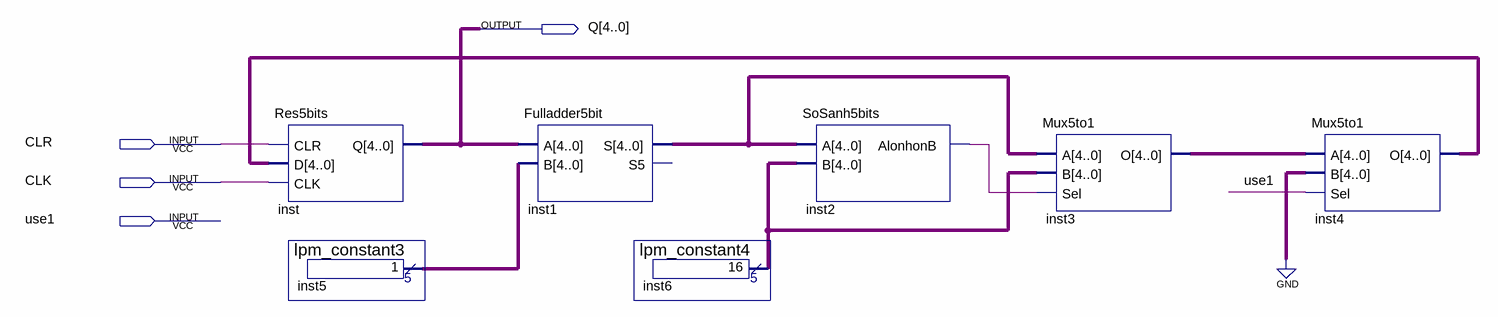
[diagram p0: schematic sheet]
// Quartus schematic Cooldown_block.bdf as structural Verilog: 7 symbols, 4 pins
module Cooldown_block (
  input  CLR,
  input  CLK,
  input  use1,
  output [4:0] Q
);

  wire inst2_alonhonb;
  wire [4:0] inst1_s, inst3_o, inst4_o, inst5_result, inst6_result;

  Res5bits inst (.CLR(CLR), .D(inst4_o), .CLK(CLK), .Q(Q));
  lpm_constant3 inst5 (.result(inst5_result));
  Fulladder5bit inst1 (.A(Q), .B(inst5_result), .S(inst1_s));  // open: S5
  lpm_constant4 inst6 (.result(inst6_result));
  SoSanh5bits inst2 (.A(inst1_s), .B(inst6_result), .AlonhonB(inst2_alonhonb));
  Mux5to1 inst3 (.A(inst1_s), .B(inst6_result), .Sel(inst2_alonhonb), .O(inst3_o));
  Mux5to1 inst4 (.A(inst3_o), .B({5{1'b0}}), .Sel(use1), .O(inst4_o));
endmodule
